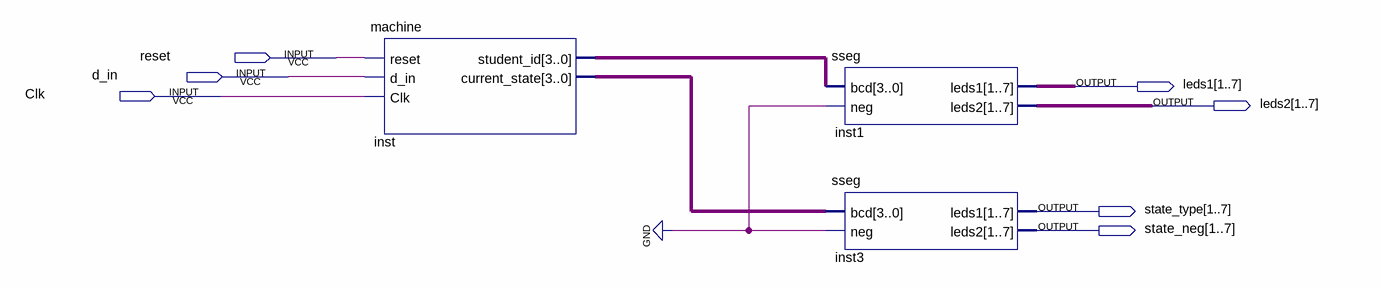
[diagram p0: schematic sheet]
// Quartus schematic lab5.bdf as structural Verilog: 3 symbols, 7 pins
module lab5 (
  input  reset,
  input  d_in,
  input  Clk,
  output [1:7] leds1,
  output [1:7] leds2,
  output [1:7] state_type,
  output [1:7] state_neg
);

  wire [3:0] inst_current_state, inst_student_id;

  machine inst (
    .reset(reset), .d_in(d_in), .Clk(Clk), .student_id(inst_student_id), .current_state(inst_current_state));
  sseg inst1 (.bcd(inst_student_id), .neg(1'b0), .leds1(leds1), .leds2(leds2));
  sseg inst3 (.bcd(inst_current_state), .neg(1'b0), .leds1(state_type), .leds2(state_neg));
endmodule
